# EAGLE design bicyclelab-manager-v2 (EAGLE 5.11)
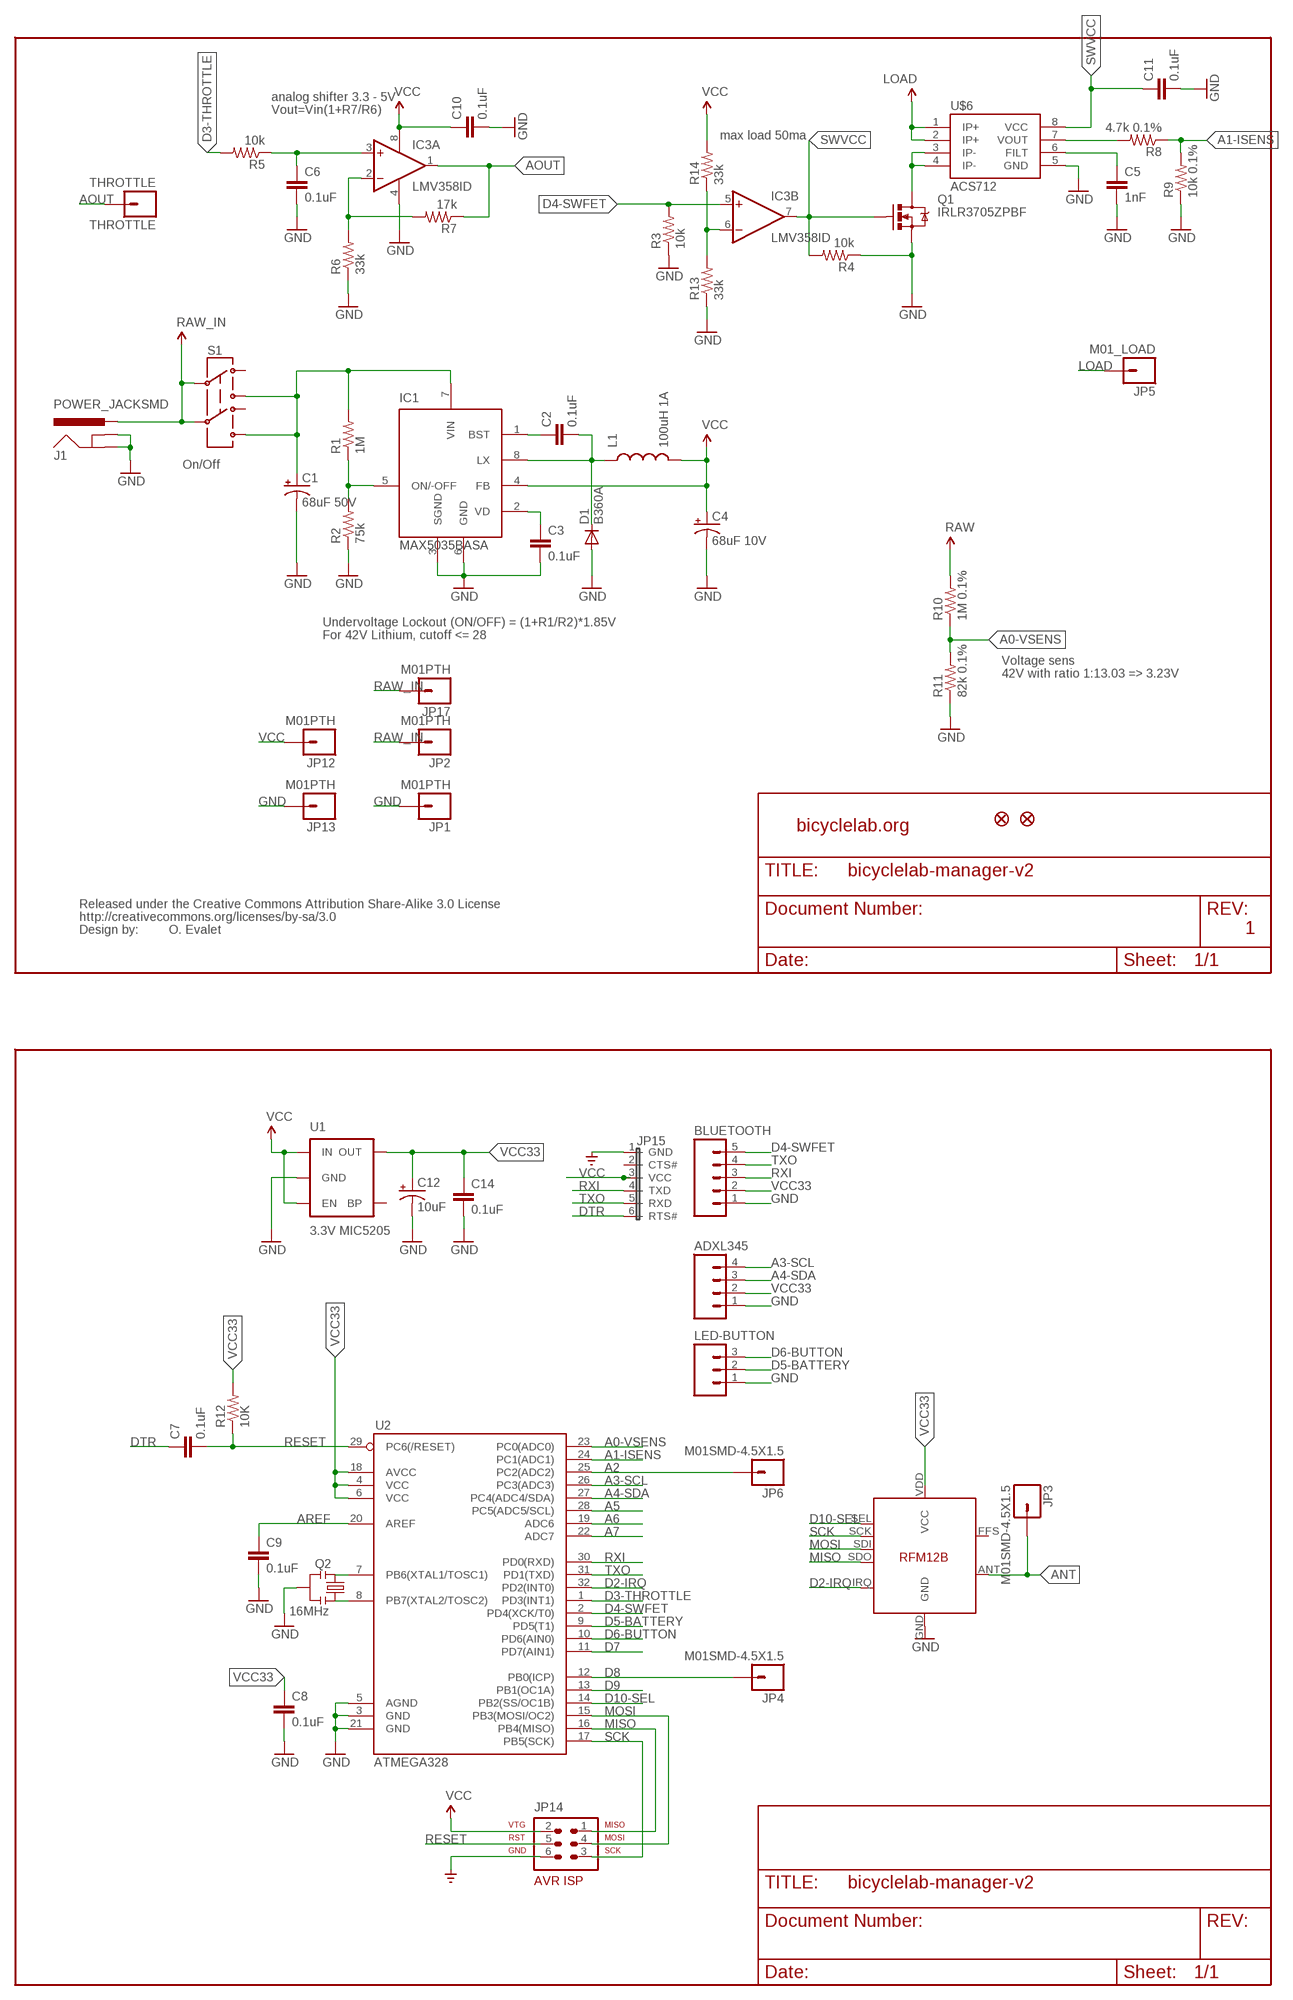
[diagram p0: schematic, sheet 1]

## Parts
ADXL345  M04PTH  [1X04]
BLUETOOTH  M05PTH  [1X05]
C1  68uF 50V  CAP_POLG  [PANASONIC_G]
C2  0.1uF  CAP0805  [0805]
C3  0.1uF  CAP0805  [0805]
C4  68uF 10V  CAP_POL6032  [EIA6032]
C5  1nF  CAP0805  [0805]
C6  0.1uF  CAP0805  [0805]
C7  0.1uF  CAP0603-CAP  [0603-CAP]
C8  0.1uF  CAP0603-CAP  [0603-CAP]
C9  0.1uF  CAP0603-CAP  [0603-CAP]
C10  0.1uF  CAP0805  [0805]
C11  0.1uF  CAP0805  [0805]
C12  10uF  CAP_POL1206  [EIA3216]
C14  0.1uF  CAP0603-CAP  [0603-CAP]
D1  B360A  DIODE-DO214AA  [DO214AA]
IC1  MAX5035BASA  [SO08]
IC3  LMV358ID  MCP602SN  [SO08]
J1  POWER_JACKSMD  [POWER_JACK_SMD]
JP1  M01PTH  [1X01]
JP2  M01PTH  [1X01]
JP3  M01SMD-4.5X1.5  [PAD-1.5X4.5]
JP4  M01SMD-4.5X1.5  [PAD-1.5X4.5]
JP5  M01_LOAD  M01PTH_2MM  [1X01_2MM]
JP6  M01SMD-4.5X1.5  [PAD-1.5X4.5]
JP12  M01PTH  [1X01]
JP13  M01PTH  [1X01]
JP14  AVR-ISP  AVR-ISP-6  [AVR-ISP-6]
JP15  FT232-UART-HEADER  [JP6]
JP17  M01PTH  [1X01]
L1  100uH 1A  INDUCTORCR54  [CR54]
LED-BUTTON  M03PTH  [1X03]
Q1  IRLR3705ZPBF  MOSFET-NCHANNELFDD8580  [DPAK]
Q2  16MHz  RESONATORSMD  [RESONATOR-SMD]
R1  1M  RESISTOR  [0805]
R2  75k  RESISTOR  [0805]
R3  10k  RESISTOR  [0805]
R4  10k  RESISTOR  [0805]
R5  10k  RESISTOR  [0805]
R6  33k  RESISTOR  [0805]
R7  17k  RESISTOR  [0805]
R8  4.7k 0.1%  RESISTOR  [0805]
R9  10k 0.1%  RESISTOR  [0805]
R10  1M 0.1%  RESISTOR  [0805]
R11  82k 0.1%  RESISTOR  [0805]
R12  10K  RESISTOR0603-RES  [0603-RES]
R13  33k  RESISTOR  [0805]
R14  33k  RESISTOR  [0805]
S1  On/Off  AYZ0202  [AYZ0202]
THROTTLE  THROTTLE  M01PTH  [1X01]
U1  3.3V MIC5205  V_REG_LDOSMD  [SOT23-5]
U2  ATMEGA328  ATMEGA168  [TQFP32-08]
U$1  RFM12B  [RFM12B]
U$3  FIDUCIAL1X2  [FIDUCIAL-1X2]
U$4  FIDUCIAL1X2  [FIDUCIAL-1X2]
U$5  CREATIVE_COMMONS  [CREATIVE_COMMONS]
U$6  ACS712  [SO08]

## Nets
A0-VSENS: R10.1 R11.2 U2.23(PC0(ADC0))
A1-ISENS: R8.1 R9.2 U2.24(PC1(ADC1))
A2: JP6.P$1 U2.25(PC2(ADC2))
A3-SCL: ADXL345.4 U2.26(PC3(ADC3))
A4-SDA: ADXL345.3 U2.27(PC4(ADC4/SDA))
A5: U2.28(PC5(ADC5/SCL))
A6: U2.19(ADC6)
A7: U2.22(ADC7)
ANT: JP3.P$1 U$1.ANT
AOUT: IC3.1(A:OUT) R7.1 THROTTLE.1
AREF: C9.1 U2.20(AREF)
D2-IRQ: U2.32(PD2(INT0)) U$1.IRQ
D3-THROTTLE: R5.2 U2.1(PD3(INT1))
D4-SWFET: BLUETOOTH.5 IC3.5(B:+IN) R3.2 U2.2(PD4(XCK/T0))
D5-BATTERY: LED-BUTTON.2 U2.9(PD5(T1))
D6-BUTTON: LED-BUTTON.3 U2.10(PD6(AIN0))
D7: U2.11(PD7(AIN1))
D8: JP4.P$1 U2.12(PB0(ICP))
D9: U2.13(PB1(OC1A))
D10-SEL: U2.14(PB2(SS/OC1B)) U$1.SEL
DTR: C7.1 JP15.6(RTS#)
GND: ADXL345.1 BLUETOOTH.1 C1.- C3.2 C4.P$2(-) C5.2 C6.2 C8.2 C9.2 C10.2 C11.2 C12.C(-) C14.2 D1.A IC1.3(SGND) IC1.6(GND) IC3.4(P:V-) J1.GND(GNDBREAK) J1.P$4(GND) JP1.1 JP13.1 JP14.6 JP15.1(GND) LED-BUTTON.1 Q1.3(S) Q2.2 R2.1 R3.1 R4.1 R6.1 R9.1 R11.1 R13.1 U1.2(GND) U2.3(GND) U2.5(AGND) U2.21(GND) U$1.GND U$6.5(GND) ; supply symbol labelled GND_
IOUT_: R8.2 U$6.7(VOUT)
L2: Q1.4(D) U$6.3(IP-) U$6.4(IP-)
LOAD: JP5.1 U$6.1(IP+) U$6.2(IP+)
MISO: JP14.1 U2.16(PB4(MISO)) U$1.SDO
MOSI: JP14.4 U2.15(PB3(MOSI/OC2)) U$1.SDI
N$1: C3.1 IC1.2(VD)
N$2: Q2.3 U2.7(PB6(XTAL1/TOSC1))
N$3: Q2.1 U2.8(PB7(XTAL2/TOSC2))
N$4: C5.1 U$6.6(FILT)
N$5: IC3.6(B:-IN) R13.2 R14.1
N$6: IC3.2(A:-IN) R6.2 R7.2
N$7: IC1.5(ON/-OFF) R1.1 R2.2
N$8: C6.1 IC3.3(A:+IN) R5.1
N$9: C2.1 IC1.1(BST)
N$10: C2.2 D1.C IC1.8(LX) L1.P$1
RAW: C1.+ IC1.7(VIN) R1.2 R10.2 S1.1 S1.4
RAW_IN: J1.VIN0(PWR) JP2.1 JP17.1 S1.2 S1.5
RESET: C7.2 JP14.5 R12.1 U2.29(PC6(/RESET))
RXI: BLUETOOTH.3 JP15.4(TXD) U2.30(PD0(RXD))
SCK: JP14.3 U2.17(PB5(SCK)) U$1.SCK
SWVCC: C11.1 IC3.7(B:OUT) Q1.1(G) R4.2 U$6.8(VCC)
TXO: BLUETOOTH.4 JP15.5(RXD) U2.31(PD1(TXD))
VCC: C4.P$1(+) C10.1 IC1.4(FB) IC3.8(P:V+) JP12.1 JP14.2 JP15.3(VCC) L1.P$2 R14.2 U1.1(IN) U1.3(EN)
VCC33: ADXL345.2 BLUETOOTH.2 C8.1 C12.A(+) C14.1 R12.2 U1.5(OUT) U2.4(VCC) U2.6(VCC) U2.18(AVCC) U$1.VDD(VCC)
Unconnected: JP15.2(CTS#) S1.3 S1.6 U1.4(BP) U$1.FFS

## Notes on the sheet
- analog shifter 3.3 - 5V
- Vout=Vin(1+R7/R6)
- max load 50ma
- Undervoltage Lockout (ON/OFF) = (1+R1/R2)*1.85V
- For 42V Lithium, cutoff <= 28
- Voltage sens
- 42V with ratio 1:13.03 => 3.23V
- bicyclelab.org
- O. Evalet | 1

## Library data of the parts
ADXL345 = 0-SparkFun:M04: Header 4 Standard 4-pin 0.1" header. Use with straight break away headers (SKU : PRT-00116), right angle break away headers (PRT-00553), swiss pins (PRT-00743), machine pins (PRT-00117), and female headers (PRT-00115). Molex polarized connector foot print use with SKU : PRT-08231 with associated crimp pins and housings. 1MM SMD Version SKU: PRT-10208
BLUETOOTH = 0-SparkFun:M05: Header 5 Standard 5-pin 0.1" header. Use with straight break away headers (SKU : PRT-00116), right angle break away headers (PRT-00553), swiss pins (PRT-00743), machine pins (PRT-00117), and female headers (PRT-00115). Molex polarized connector foot print use with SKU : PRT-08230 with associated crimp pins and housings.
C1 C4 C12 = SparkFun:CAP_POL: Capacitor Polarized These are standard SMD and PTH capacitors. Normally 10uF, 47uF, and 100uF in electrolytic and tantalum varieties. Always verify the external diameter of the through hole cap, it varies with capacity, voltage, and manufacturer. The EIA devices should be standard.
C2 C3 C5-C11 C14 = SparkFun:CAP: Capacitor Standard 0603 ceramic capacitor, and 0.1" leaded capacitor.
D1 = diode:DIODE-: DIODE
IC1 = max5035:MAX5035
IC3 = linear:MCP602: Single Op Amp 2.7V to 6.0V Single Supply CMOS Source: http://ww1.microchip.com/downloads/en/DeviceDoc/21314g.pdf
J1 = SparkFun:POWER_JACK: Power Jack This is the standard 5.5mm barrel jack for power. The PTH is the most common, proven, reliable, footprint. All others are experimental. The Slot footprint only works if the mill layer is transmitted to the PCB fab house so be warned. Spark Fun Electronics SKU : PRT-00119. Mating wall wart : TOL-00298 (and others)
JP1 JP2 JP5 JP12 JP13 JP17 THROTTLE = SparkFun:M01: Header 1 Standard 1-pin 0.1" header. Use with straight break away headers (SKU : PRT-00116), right angle break away headers (PRT-00553), swiss pins (PRT-00743), machine pins (PRT-00117), and female headers (PRT-00115).
JP3 JP4 JP6 = 0-SparkFun:M01: Header 1 Standard 1-pin 0.1" header. Use with straight break away headers (SKU : PRT-00116), right angle break away headers (PRT-00553), swiss pins (PRT-00743), machine pins (PRT-00117), and female headers (PRT-00115).
JP14 = avr-6:AVR-ISP-6: AVR ISP-6 Serial Programming Header
JP15 = connectors:FT232-UART-HEADER: JUMPER
L1 = SparkFun:INDUCTOR: Inductors Basic Inductor/Choke - 0603 and 1206. Footprints are not proven and vary greatly between part numbers.
LED-BUTTON = 0-SparkFun:M03: Header 3 Standard 3-pin 0.1" header. Use with straight break away headers (SKU : PRT-00116), right angle break away headers (PRT-00553), swiss pins (PRT-00743), machine pins (PRT-00117), and female headers (PRT-00115). Molex polarized connector foot print use with SKU : PRT-08232 with associated crimp pins and housings.
Q1 = SparkFun:MOSFET-NCHANNEL
Q2 = SparkFun:RESONATOR: Resonator Small SMD resonator. This is the itty bitty 10/20MHz resonators with built in caps. CSTCE10M0G55 and CSTCE20M0V53. Footprint has been reviewed closely but hasn't been tested yet.
R1-R14 = SparkFun:RESISTOR: Resistor Basic schematic elements and footprints for 0603, 1206, and PTH 1/10th watt (small) resistors.
S1 = SparkFun:AYZ0202: SPDT Slide Switch Simple SMD single-pull double-throw slide switch. Good for less than 350mA power switch, switching UARTs between devices, etc. Spark Fun Electronics SKU : COM-00597
U1 = SparkFun:V_REG_LDO: Voltage Regulator LDO Standard 150mA LDO voltage regulator in SOT-23 layout. Micrel part MIC5205. BP (by-pass) pin is used to lower output noise with 470pF cap.
U2 = SparkFun:ATMEGA168
U$1 = JeeParts:RFM12B
U$3 U$4 = SparkFun:FIDUCIAL: Fiducial Alignment Points Various fiducial points for machine vision alignment.
U$5 = SparkFun:CREATIVE_COMMONS
U$6 = SparkFun:ACS712

## Net classes
0 default: width 0.203 mm
1 power: width 0.508 mm

## Board
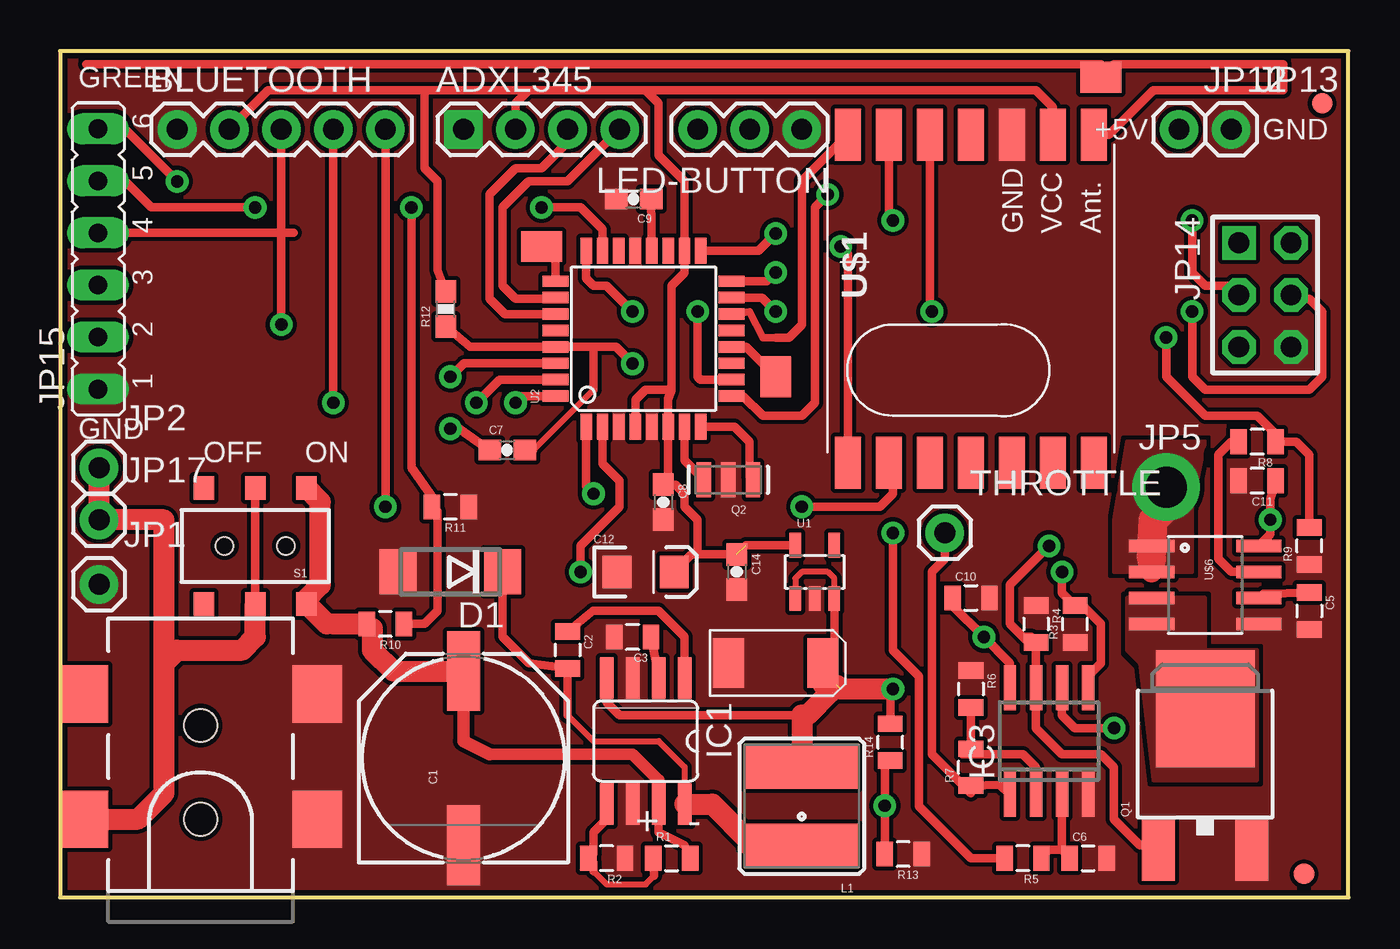
[diagram p1: board, top side]
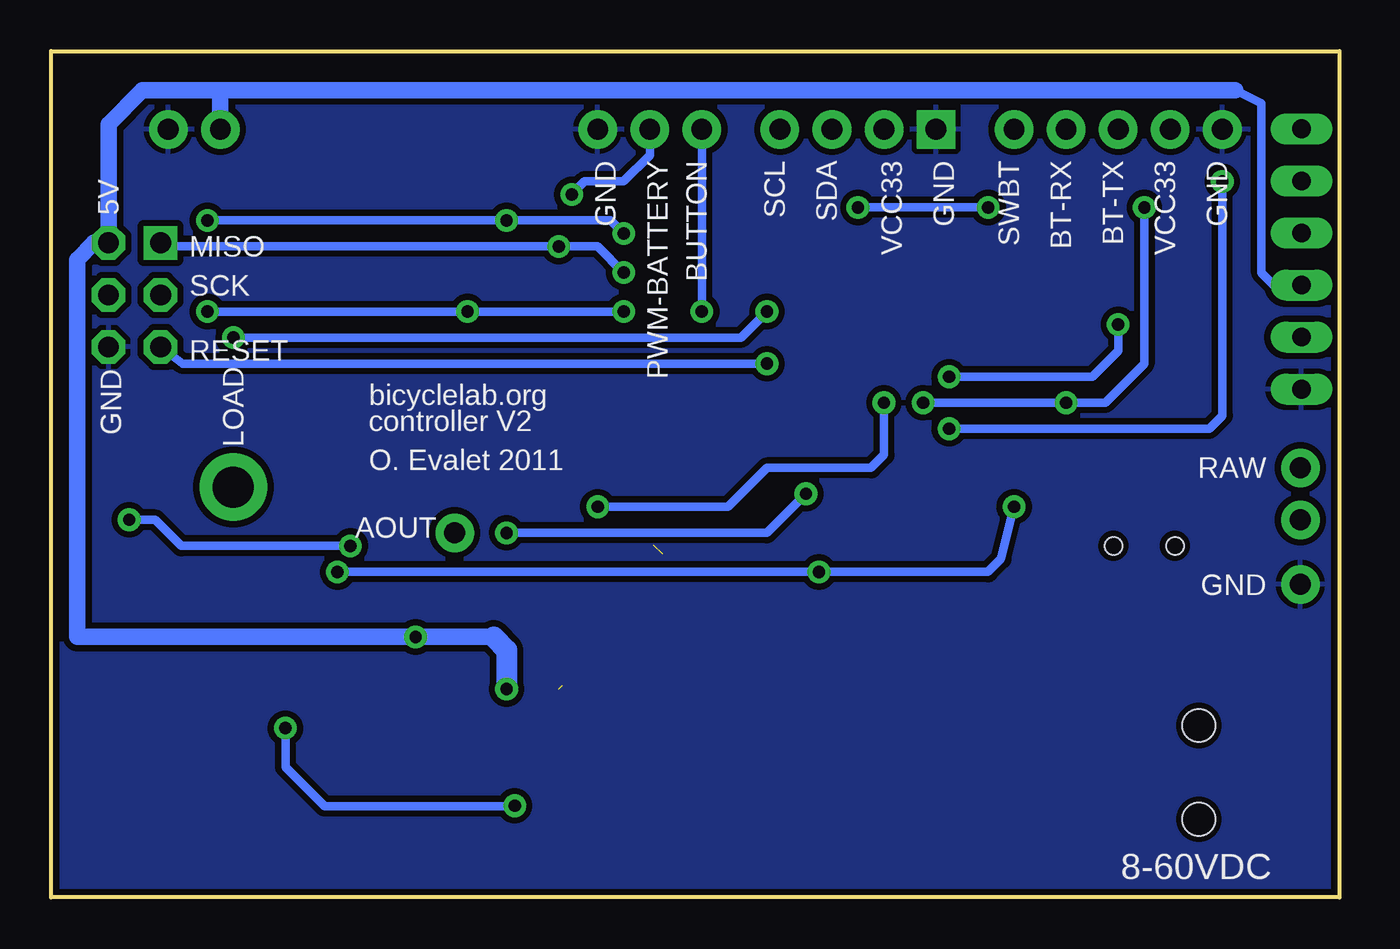
[diagram p2: board, bottom side, seen from below]

Size 62.87 x 41.27 mm. Coordinates in mm from the lower left corner, seen from the top.
Outline: 0,0 62.87,0 62.87,41.27 0,41.27 0,0
Copper layers (1*16): Top 0.035mm / dielectric 1.5mm / Bottom 0.035mm
Design rules "SparkFun": minimum track width 8mil, minimum drill 20mil, track to track 8mil, track to pad 8mil, pad to pad 8mil, via to via 8mil, smd to smd 8mil, copper to edge 10mil, drill to drill 8mil, minimum pad ring 12mil, minimum via ring 10mil, stop-mask expansion 4mil, vias tented up to drill 25mil, thermal gap 10mil

### Footprints (pad centres in the part's own frame; a part is rotated, then mirrored left to right if it is on the bottom)
1X04 = drill 1.016 pad 1.88 square: 1 0,0 | drill 1.016 pad 1.88 round: 2 2.54,0; 3 5.08,0; 4 7.62,0
1X05 = drill 1.016 pad 1.88 round: 1 0,0; 2 2.54,0; 3 5.08,0; 4 7.62,0; 5 10.16,0
PANASONIC_G = smd 3.9 x 1.6: + 4.25,0; - -4.25,0
0805 = smd 0.8 x 1.2: 1 -0.9,0; 2 0.9,0
EIA6032 = smd 1.5 x 2.4: P$1 -2.3,0; P$2 2.3,0
0603-CAP = smd 1.1 x 1: 1 -0.85,0; 2 0.85,0
EIA3216 = smd 1.4 x 1.6: A 1.4,0; C -1.4,0
DO214AA = smd 1.8 x 2.2: A 2.55,0; C -2.55,0
SO08 = smd 0.66 x 2.032: 1 -1.905,-3.073; 2 -0.635,-3.073; 3 0.635,-3.073; 4 1.905,-3.073; 5 1.905,3.073; 6 0.635,3.073; 7 -0.635,3.073; 8 -1.905,3.073
SO08' = smd 0.6 x 2.2: 1 -1.905,-2.6; 2 -0.635,-2.6; 3 0.635,-2.6; 4 1.905,-2.6; 5 1.905,2.6; 6 0.635,2.6; 7 -0.635,2.6; 8 -1.905,2.6
POWER_JACK_SMD = smd 2.8 x 2.4: GND 0,-5.7; P$4 6.1,-5.7; VIN0 0,5.7; VIN1 6.1,5.7 | hole 1.6: 0,0; 4.572,0
1X01 = drill 1.016 pad 1.88 round: 1 0,0
PAD-1.5X4.5 = smd 1.5 x 2: P$1 0,0
1X01_2MM = drill 2 pad 3.302 round: 1 0,0
AVR-ISP-6 = drill 1.016 square: 1 -2.54,-1.27 | drill 1.016 octagon: 2 -2.54,1.27; 3 0,-1.27; 4 0,1.27; 5 2.54,-1.27; 6 2.54,1.27
JP6 = drill 0.914 long: 1 -2.54,0; 2 0,0; 3 2.54,0; 4 5.08,0; 5 7.62,0; 6 10.16,0
CR54 = smd 5.5 x 2.15: P$1 0,1.92; P$2 0,-1.92
1X03 = drill 1.016 pad 1.88 round: 1 0,0; 2 2.54,0; 3 5.08,0
DPAK = smd 1.6 x 3: 1 -2.28,-5.31; 3 2.28,-5.31 | smd 4.826 x 5.715: 4 0,1.588
RESONATOR-SMD = smd 0.7 x 1.7: 1 -1.2,0; 2 0,0; 3 1.2,0
0603-RES = smd 1.1 x 1: 1 -0.85,0; 2 0.85,0
AYZ0202 = smd 1 x 1.15: 1 -2.5,2.825; 2 0,2.825; 3 2.5,2.825; 4 -2.5,-2.825; 5 0,-2.825; 6 2.5,-2.825 | hole 0.85: 1.5,0; -1.5,0
SOT23-5 = smd 0.55 x 1.2: 1 -0.95,-1.3; 2 0,-1.3; 3 0.95,-1.3; 4 0.95,1.3; 5 -0.95,1.3
TQFP32-08 = smd 1.27 x 0.559: 1 -4.293,2.8; 2 -4.293,2; 3 -4.293,1.2; 4 -4.293,0.4; 5 -4.293,-0.4; 6 -4.293,-1.2; 7 -4.293,-2; 8 -4.293,-2.8; 17 4.293,-2.8; 18 4.293,-2; 19 4.293,-1.2; 20 4.293,-0.4; 21 4.293,0.4; 22 4.293,1.2; 23 4.293,2; 24 4.293,2.8 | smd 0.559 x 1.27: 9 -2.8,-4.293; 10 -2,-4.293; 11 -1.2,-4.293; 12 -0.4,-4.293; 13 0.4,-4.293; 14 1.2,-4.293; 15 2,-4.293; 16 2.8,-4.293; 25 2.8,4.293; 26 2,4.293; 27 1.2,4.293; 28 0.4,4.293; 29 -0.4,4.293; 30 -1.2,4.293; 31 -2,4.293; 32 -2.8,4.293
RFM12B = smd 2.54 x 1.27: ANT 8,-6; FFS -8,2; GND 8,-2; IRQ -8,4; P$8 -8,0; P$9 -8,-2; P$10 -8,-4; P$12 -8,-6; P$16 8,0; SCK 8,4; SDI 8,2; SDO -8,6; SEL 8,6; VDD 8,-4
FIDUCIAL-1X2 = smd 1 x 1: 1 0,0
SO08'' = smd 0.61 x 2.21: 1 -1.905,-2.616; 2 -0.635,-2.616; 3 0.635,-2.616; 4 1.905,-2.616; 5 1.905,2.616; 6 0.635,2.616; 7 -0.635,2.616; 8 -1.905,2.616

### Placement (x,y rotation side)
ADXL345  19.68,37.47 0 top
BLUETOOTH  5.71,37.47 0 top
C1  19.68,6.79 90 top
C2  24.77,12.06 270 top
C3  27.94,12.7 180 top
C4  34.92,11.43 180 top
C5  60.96,13.97 270 top
C6  50.16,1.91 0 top
C7  21.82,21.82 0 top
C8  29.44,19.28 270 top
C9  27.99,34.06 180 top
C10  44.45,14.61 0 top
C11  58.42,20.32 180 top
C12  28.57,15.88 0 top
C14  33.02,15.88 270 top
D1  19.05,15.88 180 top
IC1  28.57,7.62 180 top
IC3  LMV358ID  [SO08']  48.26,7.62 0 top
J1  6.86,3.81 90 top
JP1  1.91,15.27 0 top
JP2  1.91,20.95 0 top
JP3  50.8,40.01 90 top
JP4  34.92,25.4 0 top
JP5  53.98,20.02 0 top
JP6  23.5,31.75 90 top
JP12  54.61,37.47 0 top
JP13  57.15,37.47 0 top
JP14  58.8,29.39 270 top
JP15  1.85,27.33 90 top
JP17  1.91,18.41 0 top
L1  36.2,4.45 180 top
LED-BUTTON  36.2,37.47 180 top
Q1  55.88,7.62 0 top
Q2  32.61,20.37 180 top
R1  29.84,1.91 0 top
R2  26.67,1.91 180 top
R3  49.53,13.34 90 top
R4  47.62,13.34 270 top
R5  46.99,1.91 180 top
R6  44.45,10.16 270 top
R7  44.45,6.35 90 top
R8  58.42,22.23 180 top
R9  60.96,17.14 90 top
R10  15.88,13.34 180 top
R11  19.05,19.05 180 top
R12  18.82,28.7 90 top
R13  41.15,2.11 180 top
R14  40.51,7.57 90 top
S1  9.53,17.14 180 top
THROTTLE  43.18,17.78 0 top
U1  36.83,15.88 0 top
U2  28.47,27.25 90 top
U$1  44.45,29.21 90 top
U$3  61.59,38.73 90 top
U$4  60.71,1.14 0 top
U$5  1.27,-10.16 0 top  (outside the outline)
U$6  ACS712  [SO08'']  55.88,15.24 270 top

### Tracks (layer width: path | path; a pad name or v marks a point on that pad's centre or on a via)
A0-VSENS  (via drill 0.6)
  Top 0.406: R10.1 17.78,13.34 18.41,13.97 18.41,18.84 R11.2 18.2,19.47 17.14,20.95 v17.14,33.66 | v23.5,33.66 25.4,33.66 26.47,32.58 U2.23
  Bottom 0.406: v17.14,33.66 v23.5,33.66
A1-ISENS  (via drill 0.6)
  Top 0.406: U2.24 25.67,30.21 26.04,29.84 26.67,29.84 v27.94,28.57 | v53.98,27.3 53.98,25.4 55.88,23.5 58.42,23.5 59.27,22.64 R8.1 60.33,22.23 60.96,21.59 R9.2
  Bottom 0.406: v53.98,27.3 29.21,27.3 v27.94,28.57
A2
  Top 0.406: U2.25 24.18,31.06 JP6.P$1
A3-SCL
  Top 0.406: U2.26 24.14,29.21 22.23,29.21 21.59,29.84 21.59,33.66 22.86,34.92 24.77,34.92 ADXL345.4
A4-SDA
  Top 0.406: U2.27 21.71,28.45 20.95,29.21 20.95,34.29 22.23,35.56 23.5,35.56 24.77,36.83 ADXL345.3
ANT
  Top 0.406: U$1.ANT 51.18,37.21 53.34,39.37 59.69,39.37 59.69,40.64 51.44,40.64 JP3.P$1 50.8,40.64 1.27,40.64
AOUT
  Top 0.406: IC3.1 45.88,5.5 R7.1 44.45,5.08 42.55,6.99 42.55,15.88 43.18,16.51 THROTTLE.1
AREF
  Top 0.406: C9.1 28.87,32.76 U2.20
D2-IRQ  (via drill 0.6)
  Top 0.406: U2.32 22.55,24.45 v22.23,24.13 | v36.2,19.05 40.01,19.05 40.64,19.68 40.64,21.02 U$1.IRQ
  Bottom 0.406: v22.23,24.13 22.23,21.59 22.86,20.95 27.94,20.95 29.84,19.05 v36.2,19.05
D3-THROTTLE  (via drill 0.6)
  Top 0.406: R5.2 44.45,1.91 41.91,4.45 41.91,10.79 40.64,12.06 v40.64,17.78 | v26.04,19.68 25.67,20.05 U2.1
  Bottom 0.406: v40.64,17.78 27.94,17.78 v26.04,19.68
D4-SWFET  (via drill 0.6)
  Top 0.406: IC3.5 50.16,10.79 50.8,11.43 50.8,13.34 49.95,14.19 R3.2 48.9,14.87 v48.9,15.88 | U2.2 26.47,21.15 27.3,20.32 27.3,19.05 25.4,17.14 v25.4,15.88 | v15.88,19.05 BLUETOOTH.5
  Bottom 0.406: v48.9,15.88 v25.4,15.88 17.14,15.88 16.51,16.51 v15.88,19.05
D5-BATTERY  (via drill 0.6)
  Top 0.406: v37.47,34.29 36.83,33.66 36.83,24.13 36.2,23.5 34.29,23.5 33.33,24.45 U2.9
  Bottom 0.406: v37.47,34.29 36.83,34.92 34.92,34.92 33.66,36.2 LED-BUTTON.2
D6-BUTTON  (via drill 0.6)
  Top 0.406: U2.10 31.26,25.25 31.11,25.4 v31.11,28.57
  Bottom 0.406: v31.11,28.57 LED-BUTTON.3
D8
  Top 0.406: U2.12 33.47,26.85 JP4.P$1
D10-SEL
  Top 0.356: U2.14 33.66,28.57 34.29,27.3 34.92,27.3
  Top 0.406: 34.92,27.3 35.56,27.3 36.2,27.94 36.2,34.95 U$1.SEL
DTR  (via drill 0.6)
  Top 0.406: v19.05,22.86 19.47,22.86 C7.1 | v5.71,34.92 3.15,37.49 JP15.6
  Bottom 0.406: v19.05,22.86 6.35,22.86 5.71,23.5 v5.71,34.92
GND
  pour Bottom (isolate 0.305): 0,41.27 62.87,41.27 62.87,0 0,0
  pour Top (isolate 0.203, rank 2, no thermals): 0,0 0,41.27 62.87,41.27 62.87,0
IOUT_
  Top 0.406: U$6.7 57.15,15.88 56.52,16.51 56.52,21.59 57.15,22.23 R8.2
L2
  pour Top (isolate 0.508, no thermals): 53.34,5.71 58.42,5.71 58.42,12.06 55.88,12.06 55.88,14.61 52.07,14.61 52.07,12.06 52.7,11.43
LOAD
  Top 1.016: U$6.2 53.26,16.51 U$6.1
  Top 1.422: JP5.1 53.98,19.05 53.34,18.41 53.26,16.51
  pour Top (isolate 0.508, no thermals): 51.44,15.88 55.24,15.88 55.24,19.05 55.88,22.23 52.07,22.23 51.44,18.41
MISO  (via drill 0.6)
  Top 0.406: U2.16 34.5,30.05 v34.92,30.48 | U$1.SDO 38.45,31.4 v38.1,31.75
  Bottom 0.406: v34.92,30.48 36.2,31.75 37.47,31.75 v38.1,31.75 57.35,31.75 JP14.1
MOSI  (via drill 0.6)
  Top 0.406: U2.15 34.25,29.25 v34.92,28.57 | v55.24,28.57 55.24,25.4 55.88,24.77 60.96,24.77 61.59,25.4 61.59,28.57 60.96,29.21 60.25,29.21 JP14.4 | U$1.SDI 42.45,28.67 v42.55,28.57
  Bottom 0.406: v34.92,28.57 v42.55,28.57 43.18,28.57 v55.24,28.57
N$1
  Top 0.406: C3.1 29.23,10.71 IC1.2
N$2
  Top 0.406: Q2.3 30.47,21.31 U2.7
N$3
  Top 0.406: Q2.1 33.66,20.53 33.66,22.23 32.92,22.96 U2.8
N$4
  Top 0.406: C5.1 58.71,14.82 U$6.6
N$5  (via drill 0.6)
  Top 0.406: R14.1 40.25,6.4 v40.25,4.47 R13.2 | IC3.6 48.9,8.89 49.53,8.26 v51.44,8.26
  Bottom 0.406: v40.25,4.47 40.27,4.45 49.53,4.45 51.44,6.35 v51.44,8.26
N$6
  Top 0.406: IC3.2 47.62,6.35 46.99,6.99 44.03,6.99 R7.2 R6.2
N$7
  Top 0.305: 29,1.05 28.57,0.64 26.67,0.64 26.04,1.27
  Top 0.406: IC1.5 26.67,3.81 26.04,3.17 26.04,2.12 R2.2 26.04,1.69 26.04,1.27 | 29,1.05 R1.1
N$8
  Top 0.406: 48.9,2.33 IC3.3 | 48.9,2.33 C6.1 | 48.9,2.33 48.26,2.33 R5.1
N$9
  Top 0.406: IC1.1 30.48,12.7 29.21,13.97 26.02,13.97 C2.1
N$10
  Top 0.305: 24.77,8.89 26.04,7.62 29.21,7.62 30.48,6.35 IC1.8
  Top 0.406: 24.77,8.89 C2.2 22.88,11.41 21.59,12.7 21.59,15.87 D1.C
  Top 1.016: IC1.8 31.83,4.55 33.66,2.72 33.66,2.54 33.67,2.52 L1.P$1
RAW
  Top 0.406: R10.2 15.24,13.12 | IC1.7 29.21,3.17 30.48,2.54 R1.2
  Top 0.559: 20.95,6.99 27.94,6.99 29.21,5.71
  Top 0.61: C1.+ 19.68,7.62 20.95,6.99 | 29.21,5.71 IC1.7
  Top 0.762: S1.1 12.03,14.56
  Top 0.813: 13.01,13.34 13.34,13.34
  Top 1.016: C1.+ 16.27,11.04 15.24,12.06 15.24,13.12 | 13.34,13.34 R10.2 | S1.1 13.01,13.34 | 12.03,14.56 12.7,15.24 12.7,19.3 S1.4
RAW_IN
  Top 0.406: S1.2 S1.5
  Top 1.016: J1.VIN0 3.81,3.81 5.08,5.08 5.08,11.43 | 5.08,11.43 5.71,12.06 8.89,12.06 9.53,12.7 S1.2 | 5.08,11.43 5.08,18.41 JP17.1 JP2.1
RESET  (via drill 0.6)
  Top 0.305: 23.09,21.82 26.04,24.77
  Top 0.406: R12.1 20.01,26.85 U2.29 26.04,26.85 | 26.04,26.85 27.12,26.85 v27.94,26.04 | C7.2 23.09,21.82 | 26.04,24.77 26.04,26.85
  Bottom 0.406: v27.94,26.04 56.44,26.04 JP14.5
RXI  (via drill 0.6)
  Top 0.406: U2.30 19.7,26.05 v19.05,25.4 | 10.79,32.38 v10.79,27.94 | 10.79,32.38 BLUETOOTH.3 | 10.79,32.38 11.4,32.41 JP15.4
  Bottom 0.406: v10.79,27.94 10.79,26.67 12.06,25.4 v19.05,25.4
SCK  (via drill 0.6)
  Top 0.406: U2.17 34.09,31.55 v34.92,32.38 | v55.24,33.02 55.24,30.48 55.88,29.84 57.07,29.84 JP14.3 | U$1.SCK 40.45,33.21 v40.64,33.02
  Bottom 0.406: v34.92,32.38 35.56,33.02 v40.64,33.02 41.27,33.02 v55.24,33.02
SWVCC  (via drill 0.6)
  Top 0.406: 46.99,12.7 47.41,12.7 R4.2 | R4.2 IC3.7 47.62,8.26 48.9,6.99 50.8,6.99 51.44,6.35 51.44,3.81 52.7,2.54 53.37,2.54 Q1.1 | R4.2 47.26,12.44 46.35,13.34 46.35,15.24 v48.26,17.14 | C11.1 59.05,19.42 v59.05,18.41 59.05,17.7 U$6.8
  Bottom 0.406: v59.05,18.41 57.78,18.41 56.52,17.14 v48.26,17.14
TXO  (via drill 0.6)
  Top 0.406: U2.31 21.44,25.25 v20.32,24.13 | v13.34,24.13 BLUETOOTH.4 | v9.53,33.66 4.45,33.66 3.15,34.95 JP15.5
  Bottom 0.406: v20.32,24.13 v13.34,24.13 11.43,24.13 9.53,26.04 v9.53,33.66
VCC  (via drill 0.6)  (1 unrouted)
  Top 0.305: U1.3 37.78,15.56 37.47,15.88 36.2,15.88 35.88,15.56 U1.1
  Top 0.406: IC1.4 26.67,9.53 27.3,8.89 36.2,8.89 36.47,8.89 | IC3.8 46.35,11.43 v45.09,12.7 43.55,14.23 C10.1 | C4.P$1 37.78,11.98 U1.3 | v40.64,10.16 40.51,10.03 R14.2
  Top 1.016: v40.64,10.16 38.1,10.16 | 36.47,8.89 37.6,10.02 | 37.6,10.02 37.92,10.34 | 36.2,8.89 L1.P$2 | C4.P$1 37.23,10.4 37.6,10.02
  Bottom 0.406: 5.08,39.37 3.81,38.73 3.81,30.48 3.2,29.87 JP15.3
  Bottom 0.813: 41.27,12.7 v45.09,12.7 61.59,12.7 61.59,31.11 60.78,31.93 JP14.2 60.07,37.72 58.42,39.37 54.61,39.37 | 54.61,39.37 JP12.1 | 5.08,39.37 54.61,39.37
  Bottom 1.016: v40.64,10.16 40.64,12.06 41.27,12.7
VCC33  (1 unrouted)
  Top 0.406: 29.84,24.77 29.67,24.3 U2.6 29.67,20.36 C8.1 | 29.84,24.77 28.57,24.77 28.07,24.26 U2.4 | 33.47,17.18 U1.5 | C8.1 29.25,20.32 | BLUETOOTH.2 10.16,39.37 17.78,39.37 | 17.78,39.37 22.86,39.37 | 22.86,39.37 22.23,38.73 ADXL345.2 | 22.86,39.37 28.57,39.37 | 31.11,16.73 30.82,16.73 C12.A | 31.11,16.73 C14.1 | C8.1 30.04,20.13 30.48,19.68 30.48,19.05 31.11,18.41 31.11,16.73 | R12.2 18.41,30.59 18.41,34.92 17.78,35.56 17.78,39.37 | 28.57,39.37 29.21,38.73 29.21,36.2 30.48,34.92 30.47,34.92 U2.18 30.47,30.49 30.48,30.48 29.84,29.84 29.84,24.77 | U$1.VDD 48.45,38.55 47.62,39.37 28.57,39.37

### Text on the board
tPlace: GREEN | +5V | GND | GND | OFF | ON | + | -
bPlace: GND | VCC33 | BT-TX | BT-RX | SWBT | GND | VCC33 | SDA | SCL | BUTTON | PWM-BATTERY | GND | 5V | MISO | SCK | RESET | GND | bicyclelab.org | controller V2 | LOAD | RAW | O. Evalet 2011 | AOUT | GND | 8-60VDC